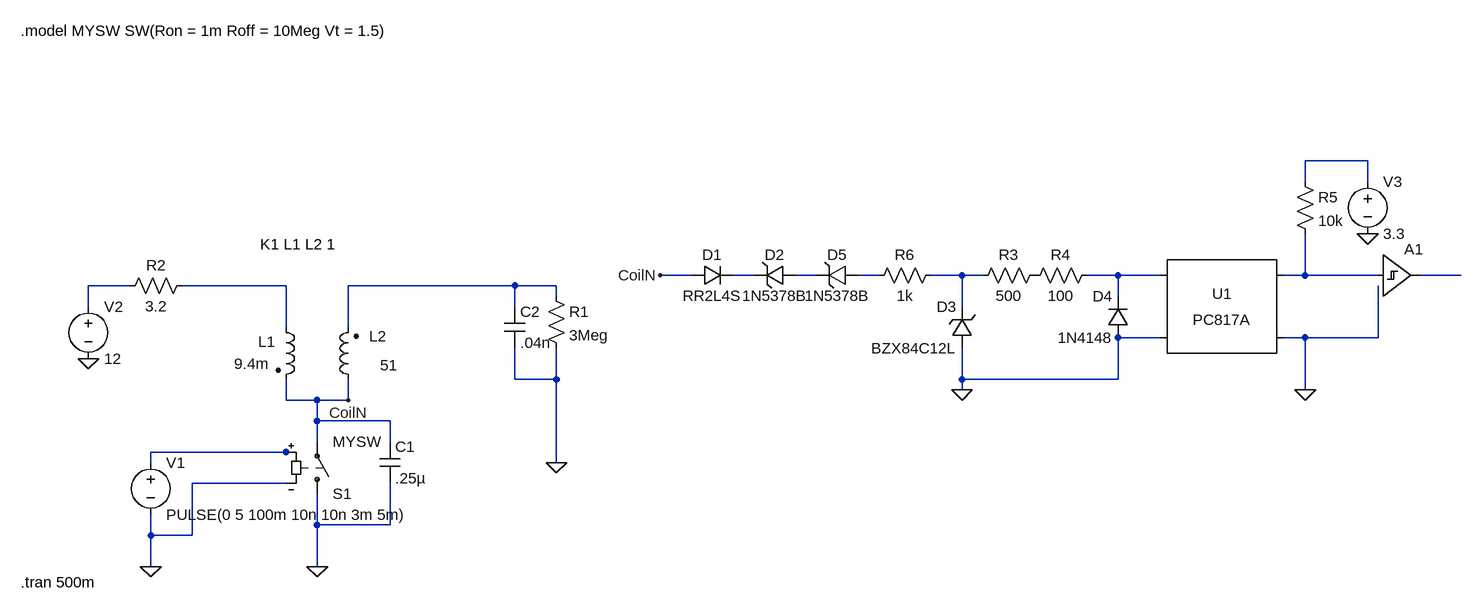
[diagram p0: schematic coil_sim.asc]
coil_sim.asc, the LTspice schematic file:
Version 4
SHEET 1 1748 680
WIRE 1600 -272 1504 -272
WIRE 1504 -240 1504 -272
WIRE 1600 -240 1600 -272
WIRE 560 -96 512 -96
WIRE 656 -96 624 -96
WIRE 752 -96 720 -96
WIRE 848 -96 816 -96
WIRE 976 -96 928 -96
WIRE 1008 -96 976 -96
WIRE 1216 -96 1168 -96
WIRE 1280 -96 1216 -96
WIRE 1504 -96 1504 -160
WIRE 1504 -96 1472 -96
WIRE 1616 -96 1504 -96
WIRE 1744 -96 1680 -96
WIRE -304 -80 -368 -80
WIRE -64 -80 -224 -80
WIRE 288 -80 32 -80
WIRE 352 -80 288 -80
WIRE 352 -64 352 -80
WIRE 1216 -64 1216 -96
WIRE -368 -48 -368 -80
WIRE 288 -48 288 -80
WIRE 976 -48 976 -96
WIRE -64 -16 -64 -80
WIRE 32 -16 32 -80
WIRE 1280 0 1216 0
WIRE 1504 0 1472 0
WIRE 1616 0 1616 -80
WIRE 1616 0 1504 0
WIRE 288 64 288 16
WIRE 352 64 352 16
WIRE 352 64 288 64
WIRE 976 64 976 16
WIRE 1216 64 1216 0
WIRE 1216 64 976 64
WIRE 976 80 976 64
WIRE 1504 80 1504 0
WIRE -64 96 -64 64
WIRE -16 96 -64 96
WIRE 32 96 32 64
WIRE 32 96 -16 96
WIRE -16 128 -16 96
WIRE 96 128 -16 128
WIRE -16 160 -16 128
WIRE 96 160 96 128
WIRE -64 176 -272 176
WIRE -48 176 -64 176
WIRE -272 192 -272 176
WIRE 352 192 352 64
WIRE -64 224 -208 224
WIRE -16 288 -16 240
WIRE 96 288 96 224
WIRE 96 288 -16 288
WIRE -272 304 -272 272
WIRE -208 304 -208 224
WIRE -208 304 -272 304
WIRE -272 352 -272 304
WIRE -16 352 -16 288
FLAG 352 192 0
FLAG -16 352 0
FLAG -272 352 0
FLAG -368 32 0
FLAG 32 96 CoilN
FLAG 512 -96 CoilN
FLAG 976 80 0
FLAG 1600 -160 0
FLAG 1504 80 0
SYMBOL sw -16 256 M180
SYMATTR InstName S1
SYMATTR Value MYSW
SYMBOL ind2 -80 -32 R0
WINDOW 0 -27 38 Left 2
WINDOW 3 -64 72 Left 2
SYMATTR InstName L1
SYMATTR Value 9.4m
SYMATTR Type ind
SYMBOL ind2 48 80 R180
WINDOW 0 -43 82 Left 2
WINDOW 3 -60 38 Left 2
SYMATTR InstName L2
SYMATTR Value 51
SYMATTR Type ind
SYMATTR SpiceLine Rser=7.5k
SYMBOL res 336 -80 R0
SYMATTR InstName R1
SYMATTR Value 3Meg
SYMBOL voltage -272 176 R0
WINDOW 123 0 0 Left 0
WINDOW 39 0 0 Left 0
SYMATTR InstName V1
SYMATTR Value PULSE(0 5 100m 10n 10n 3m 5m)
SYMBOL cap 80 160 R0
SYMATTR InstName C1
SYMATTR Value .25µ
SYMBOL cap 272 -48 R0
SYMATTR InstName C2
SYMATTR Value .04n
SYMBOL res -208 -96 R90
WINDOW 0 0 56 VBottom 2
WINDOW 3 32 56 VTop 2
SYMATTR InstName R2
SYMATTR Value 3.2
SYMBOL voltage -368 -64 R0
WINDOW 123 0 0 Left 0
WINDOW 39 0 0 Left 0
SYMATTR InstName V2
SYMATTR Value 12
SYMBOL diode 560 -80 R270
WINDOW 0 32 32 VTop 2
WINDOW 3 0 32 VBottom 2
SYMATTR InstName D1
SYMATTR Value RR2L4S
SYMBOL zener 720 -112 R90
WINDOW 0 0 32 VBottom 2
WINDOW 3 32 32 VTop 2
SYMATTR InstName D2
SYMATTR Value 1N5378B
SYMATTR Description Diode
SYMATTR Type diode
SYMBOL zener 992 16 R180
WINDOW 0 24 64 Left 2
WINDOW 3 24 0 Left 2
SYMATTR InstName D3
SYMATTR Value BZX84C12L
SYMATTR Description Diode
SYMATTR Type diode
SYMBOL res 1104 -112 R90
WINDOW 0 0 56 VBottom 2
WINDOW 3 32 56 VTop 2
SYMATTR InstName R3
SYMATTR Value 500
SYMBOL res 1184 -112 R90
WINDOW 0 0 56 VBottom 2
WINDOW 3 32 56 VTop 2
SYMATTR InstName R4
SYMATTR Value 100
SYMBOL diode 1232 0 R180
WINDOW 0 24 64 Left 2
WINDOW 3 24 0 Left 2
SYMATTR InstName D4
SYMATTR Value 1N4148
SYMBOL Optos\\PC817A 1376 -48 R0
SYMATTR InstName U1
SYMBOL res 1488 -256 R0
SYMATTR InstName R5
SYMATTR Value 10k
SYMBOL voltage 1600 -256 R0
WINDOW 123 0 0 Left 0
WINDOW 39 0 0 Left 0
SYMATTR InstName V3
SYMATTR Value 3.3
SYMBOL res 944 -112 R90
WINDOW 0 0 56 VBottom 2
WINDOW 3 32 56 VTop 2
SYMATTR InstName R6
SYMATTR Value 1k
SYMBOL Digital\\schmtbuf 1616 -160 R0
SYMATTR InstName A1
SYMBOL zener 816 -112 R90
WINDOW 0 0 32 VBottom 2
WINDOW 3 32 32 VTop 2
SYMATTR InstName D5
SYMATTR Value 1N5378B
SYMATTR Description Diode
SYMATTR Type diode
TEXT -472 -472 Left 2 !.model MYSW SW(Ron = 1m Roff = 10Meg Vt = 1.5)
TEXT -104 -144 Left 2 !K1 L1 L2 1
TEXT -472 376 Left 2 !.tran 500m

The netlist it stands for:
* coil_sim.asc
S1 0 CoilN N012 0 MYSW
L1 N010 CoilN 9.4m
L2 CoilN N011 51 Rser=7.5k
R1 N011 0 3Meg
V1 N012 0 PULSE(0 5 100m 10n 10n 3m 5m)
C1 CoilN 0 .25µ
C2 N011 0 .04n
R2 N010 N009 3.2
V2 N009 0 12
D1 CoilN N002 RR2L4S
D2 N003 N002 1N5378B
D3 0 N005 BZX84C12L
R3 P001 N005 500
R4 N006 P001 100
D4 0 N006 1N4148
XU1 N006 0 N007 0 PC817 Igain=1m
R5 N001 N007 10k
V3 N001 0 3.3
R6 N005 N004 1k
A1 N007 0 0 0 0 0 N008 0 SCHMITT
D5 N004 N003 1N5378B
.model D D
.lib standard.dio
.model MYSW SW(Ron = 1m Roff = 10Meg Vt = 1.5)
K1 L1 L2 1
.tran 500m
.lib PC817.sub
.backanno
.end